# EasyEDA Pro project Schematics with ESP32.eprj

# Schematic ESP-32-rect
Board Name: ESP-32-rect; Create Date: 2026-05-15; Page Name: ESP-32; Project Name: Schematics with ESP32; Schematic Name: ESP-32-rect; Update Date: 2026-05-16; Add into BOM: yes; Company: Your Company; Convert to PCB: yes; Date: 2024-03-01; Draw By: varadshinde60; REV: 1.0; Sheet: 1/1; spicePre: .
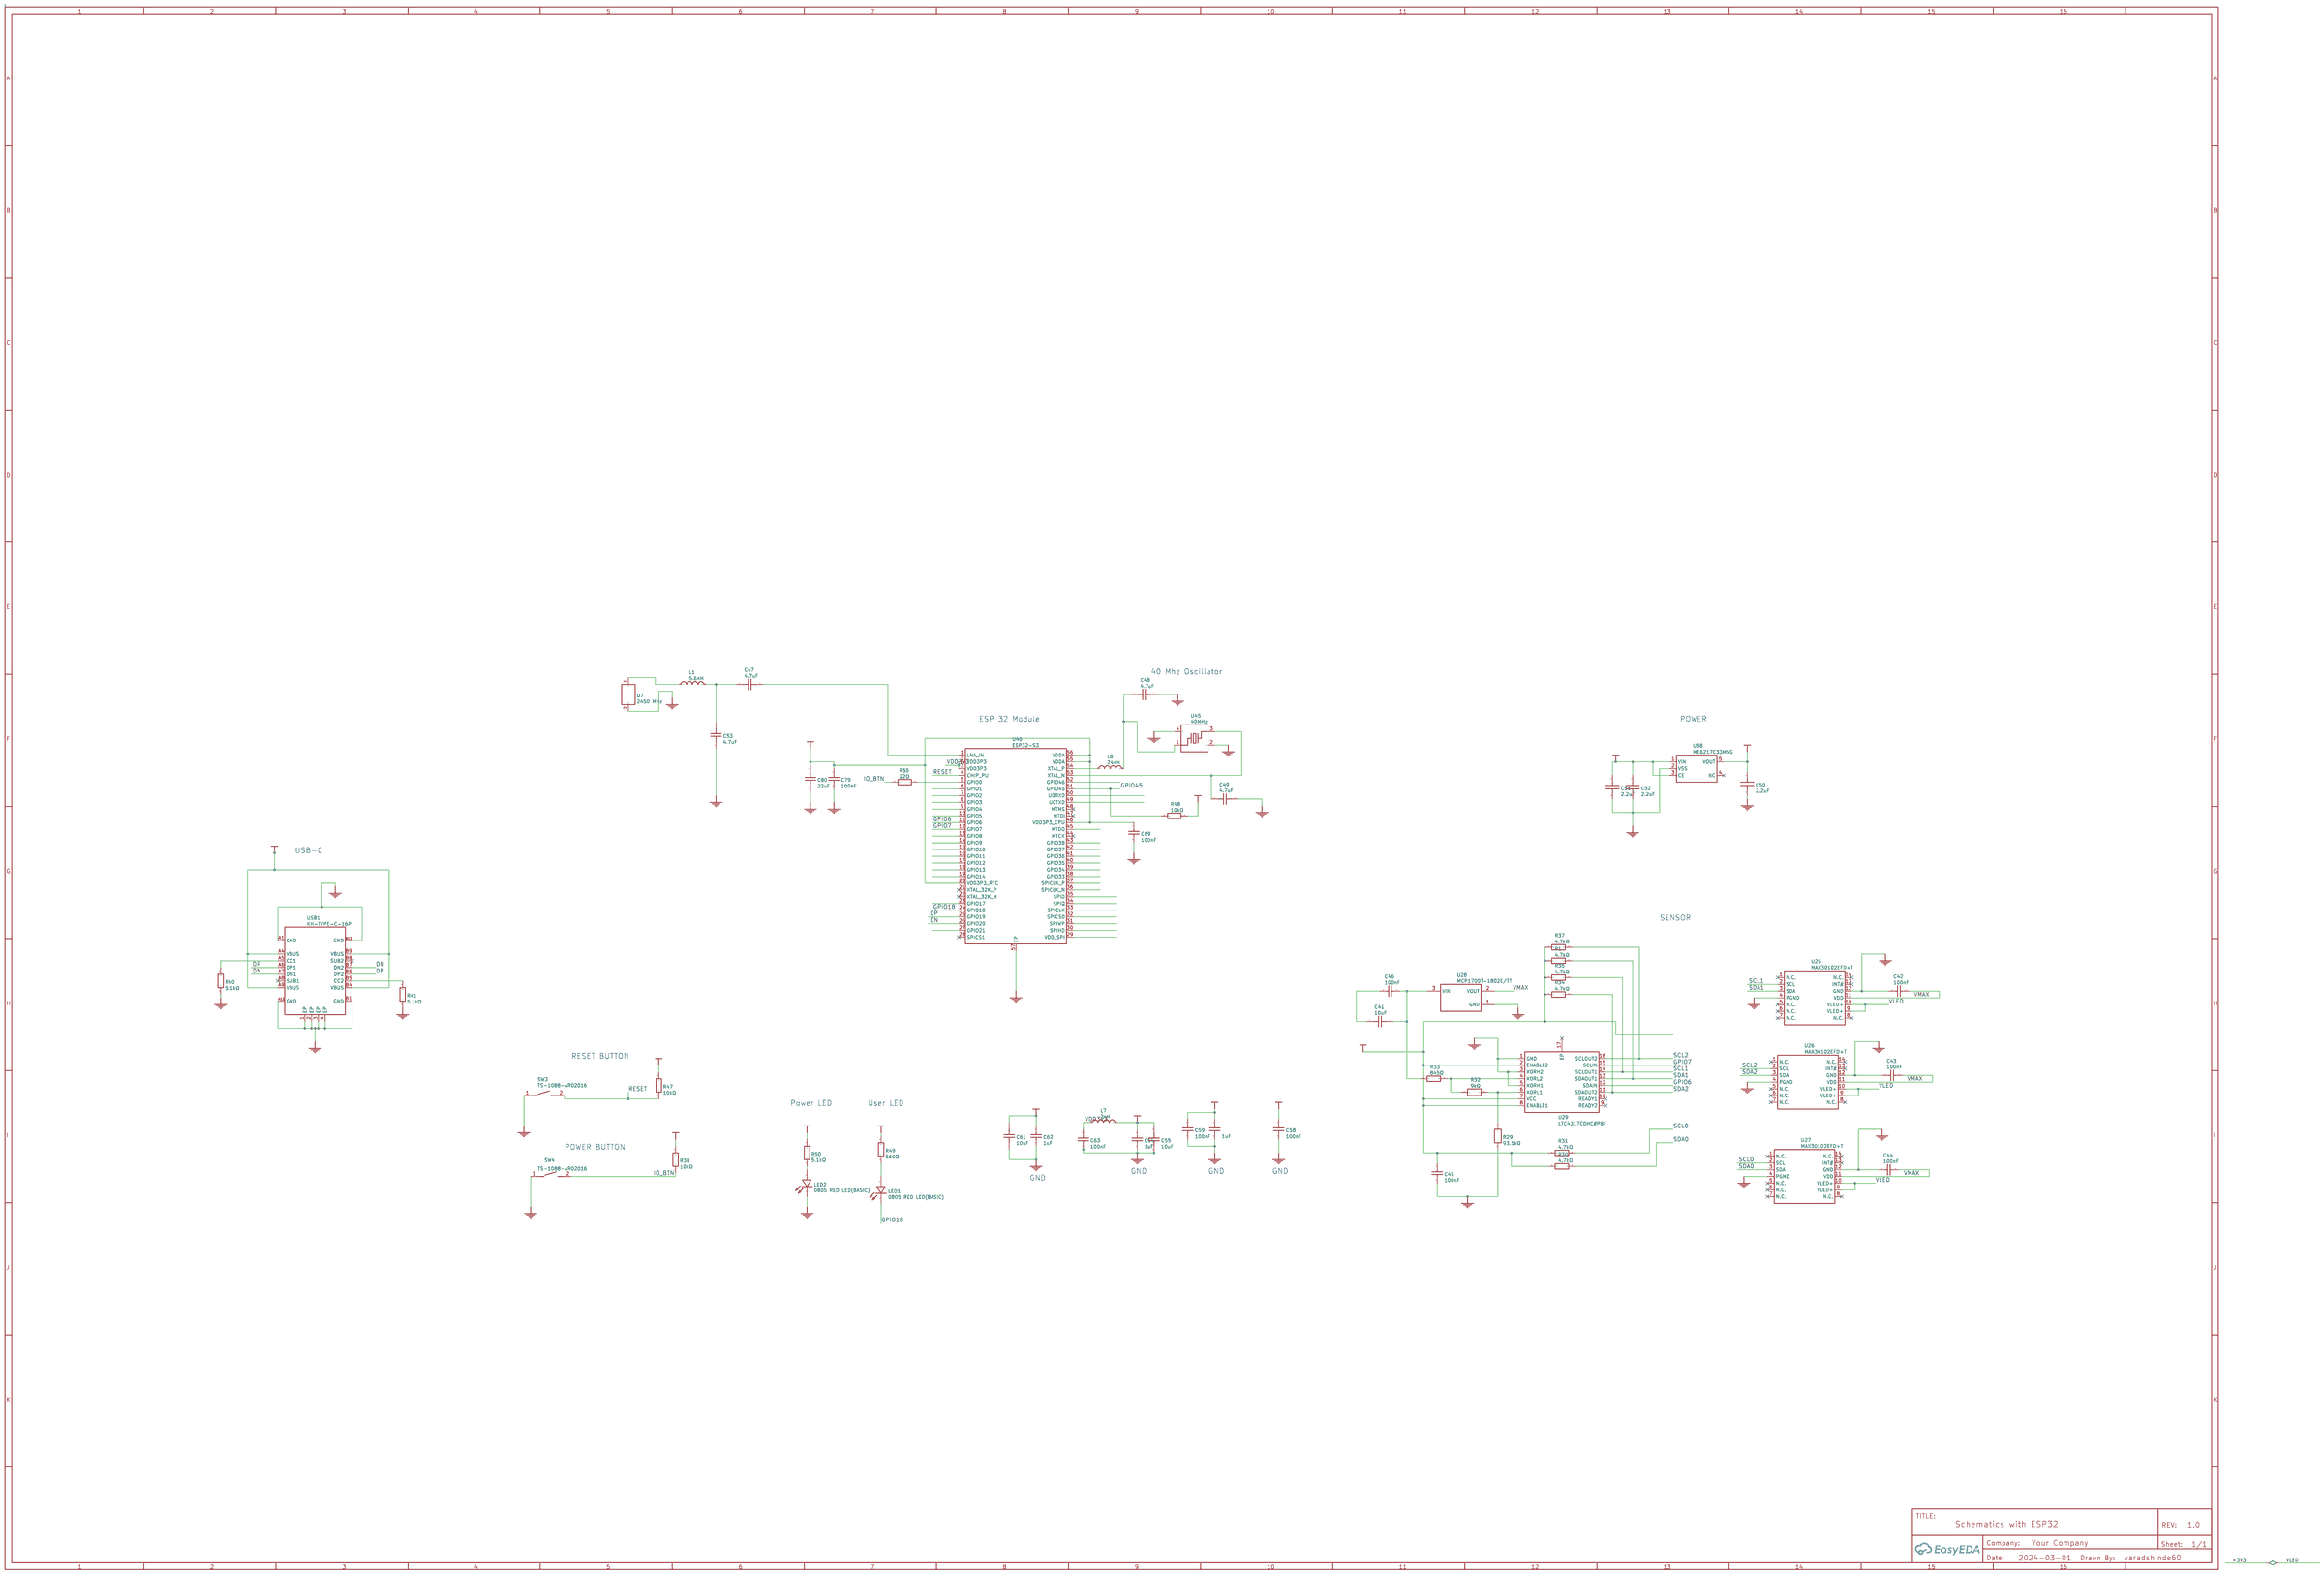
[diagram p0: schematic sheet]

## Parts
C41  10uF  [C0402]
C42  100nF  [C0402]
C43  100nF  [C0402]
C44  100nF  [C0402]
C45  100nF  [C0402]
C46  100nF  [C0402]
C47  4.7uF  [C0402]
C48  4.7uF  [C0402]
C49  4.7uF  [C0402]
C50  2.2uF  [C0402]
C51  2.2uF  [C0402]
C52  2.2uF  [C0402]
C53  4.7uF  [C0402]
C54  1uF  [C0603]
C55  10uF  [C0402]
C58  100nF  [C0402]
C59  100nF  [C0402]
C60  1uF  [C0603]
C61  10uF  [C0402]
C62  1uF  [C0603]
C63  100nF  [C0402]
C69  100nF  [C0402]
C79  100nF  [C0402]
C80  22uF  [C0805]
L1  5.6nH  [L0402]
L7  2nH  [L0201]
L8  24nH  [L0402-RD]
LED1  0805 RED LED(BASIC)  [LED0805-RD_RED]
LED2  0805 RED LED(BASIC)  [LED0805-RD_RED]
R1  4.7kΩ  [R0402]
R29  93.1kΩ  [R0201]
R30  4.7kΩ  [R0402]
R31  4.7kΩ  [R0402]
R32  9kΩ  [R0805]
R33  845Ω  [R0402]
R34  4.7kΩ  [R0402]
R35  4.7kΩ  [R0402]
R37  4.7kΩ  [R0402]
R38  10kΩ  [R0402]
R40  5.1kΩ  [R0402]
R41  5.1kΩ  [R0402]
R47  10kΩ  [R0402]
R48  10kΩ  [R0402]
R49  560Ω  [R0402]
R50  5.1kΩ  [R0402]
R55  22Ω  [R0402]
SW3  TS-1088-AR02016  [SW-SMD_L3.9-W3.0-P4.45]
SW4  TS-1088-AR02016  [SW-SMD_L3.9-W3.0-P4.45]
U7  2450 MHz  [FILTER-SMD_1206-2P-L3.2-W1.6-L]
U25  MAX30102EFD+T
U26  MAX30102EFD+T
U27  MAX30102EFD+T
U28  MCP1700T-1802E/TT  [SOT-23-3_L2.9-W1.3-P1.90-LS2.4-BR]
U29  LTC4317CDHC#PBF
U38  ME6217C33M5G  [SOT-23-5_L3.0-W1.7-P0.95-LS2.8-BR]
U45  40MHz  [CRYSTAL-SMD_4P-L3.2-W2.5-BL]
U46  ESP32-S3
USB1  KH-TYPE-C-16P  [USB-C-SMD_KH-TYPE-C-16P]

## Library data of the parts
C41 C55 C61 = 10uF: Supplier: LCSC; Supplier Part: C315248; Manufacturer: SAMSUNG(三星); Manufacturer Part: CL05A106MP5NUNC; JLCPCB Part Class: Extended Part; link: https://lcsc.com/eda_search?q=C315248&%26type=1&ref=editor; nameAlias: Value; Contributor: LCSC; spicePre: C; spiceSymbolName: CL05A106MP5NUNC_C315248
C42-C46 C58 C59 C63 C69 C79 = 100nF: Supplier: LCSC; Manufacturer Part: CL05B104KO5NNNC; Manufacturer: SAMSUNG(三星); Supplier Part: C1525; JLCPCB Part Class: Basic Part; link: https://lcsc.com/eda_search?q=C1525&%26type=1&ref=editor; nameAlias: Value; spicePre: C; spiceSymbolName: CL05B104KO5NNNC
C47-C49 C53 = 4.7uF: Supplier: LCSC; Supplier Part: C368809; Manufacturer: SAMSUNG(三星); Manufacturer Part: CL05A475KP5NRNC; JLCPCB Part Class: Extended Part; link: https://lcsc.com/eda_search?q=C368809&%26type=1&ref=editor; nameAlias: Value; Contributor: LCSC; spicePre: C; spiceSymbolName: CL05A475KP5NRNC
C50-C52 = 2.2uF: Supplier: LCSC; Manufacturer Part: CL05A225MQ5NSNC; Manufacturer: SAMSUNG(三星); Supplier Part: C12530; JLCPCB Part Class: Basic Part; nameAlias: Value; spicePre: C; spiceSymbolName: CL05A225MQ5NSNC
C54 C60 C62 = 1uF: Supplier: LCSC; Manufacturer Part: CL10A105KA8NNNC; Manufacturer: SAMSUNG(三星); Supplier Part: C5673; JLCPCB Part Class: Extended Part; link: https://lcsc.com/eda_search?q=C5673&%26type=1&ref=editor; nameAlias: Value; spicePre: C; spiceSymbolName: CL10A105KA8NNNC
C80 = 22uF: Supplier: LCSC; Supplier Part: C602037; Manufacturer: SAMSUNG(三星); Manufacturer Part: CL21A226MAYNNNE; JLCPCB Part Class: Extended Part; link: https://lcsc.com/eda_search?q=C602037&%26type=1&ref=editor; nameAlias: Value; Contributor: LCSC; spicePre: C; spiceSymbolName: CL21A226MAYNNNE
L1 = 5.6nH: Supplier: LCSC; Supplier Part: C370228; Manufacturer: Sunlord(顺络); Manufacturer Part: SDCL1005C5N6CTDFM01; JLCPCB Part Class: Extended Part; nameAlias: Value; Contributor: LCSC; spicePre: L; spiceSymbolName: SDCL1005C5N6CTDFM01
L7 = 2nH: Supplier: LCSC; Supplier Part: C307709; Manufacturer: TDK; Manufacturer Part: MLG0603P2N0BT000; JLCPCB Part Class: Extended Part; nameAlias: Value; Contributor: LCSC; spicePre: L; spiceSymbolName: MLG0603P2N0BT000
L8 = 24nH: Supplier: LCSC; Manufacturer Part: SDCL1005C24NJTDF; Manufacturer: Sunlord(顺络); Supplier Part: C74301; JLCPCB Part Class: Extended Part; nameAlias: Value; spicePre: L; spiceSymbolName: SDCL1005C24NJTDF
LED1 LED2 = 0805 RED LED(BASIC): Supplier: LCSC; Manufacturer: 国星光电; Manufacturer Part: NCD0805R1; Supplier Part: C84256; JLCPCB Part Class: Basic Part; spicePre: L
R1 R30 R31 R34 R35 R37 = 4.7kΩ: Supplier: LCSC; Manufacturer: UNI-ROYAL(厚声); Manufacturer Part: 0402WGF4701TCE; Supplier Part: C25900; JLCPCB Part Class: Basic Part; nameAlias: Value; spicePre: R; spiceSymbolName: 0402WGF4701TCE
R29 = 93.1kΩ: Supplier: LCSC; Supplier Part: C367713; Manufacturer: Walsin(华新科); Manufacturer Part: WR02X9312FTL; nameAlias: Value; Contributor: LCSC; spicePre: R; spiceSymbolName: WR02X9312FTL
R32 = 9kΩ: Supplier: LCSC; Supplier Part: C2930212; Manufacturer: FOJAN(富捷); Manufacturer Part: FRC0805F9001TS; JLCPCB Part Class: Extended Part; nameAlias: Value; Contributor: lcsc; spicePre: R; spiceSymbolName: FRC0805F9001TS
R33 = 845Ω: Supplier: LCSC; Supplier Part: C334737; Manufacturer: Walsin(华新科); Manufacturer Part: WR04X8450FTL; JLCPCB Part Class: Extended Part; nameAlias: Value; Contributor: LCSC; spicePre: R; spiceSymbolName: WR04X8450FTL
R38 R47 R48 = 10kΩ: Supplier: LCSC; Manufacturer: UNI-ROYAL(厚声); Manufacturer Part: 0402WGF1002TCE; Supplier Part: C25744; JLCPCB Part Class: Basic Part; link: https://lcsc.com/eda_search?q=C25744&%26type=1&ref=editor; nameAlias: Value; spicePre: R; spiceSymbolName: 0402WGF1002TCE
R40 R41 R50 = 5.1kΩ: Supplier: LCSC; Manufacturer: UNI-ROYAL(厚声); Manufacturer Part: 0402WGF5101TCE; Supplier Part: C25905; JLCPCB Part Class: Basic Part; link: https://lcsc.com/eda_search?q=C25905&%26type=1&ref=editor; nameAlias: Value; spicePre: R; spiceSymbolName: 0402WGF5101TCE
R49 = 560Ω: Supplier: LCSC; Manufacturer: UNI-ROYAL(厚声); Manufacturer Part: 0402WGF5600TCE; Supplier Part: C25126; JLCPCB Part Class: Extended Part; link: https://lcsc.com/eda_search?q=C25126&%26type=1&ref=editor; nameAlias: Value; spicePre: R; spiceSymbolName: 0402WGF5600TCE
R55 = 22Ω: Supplier: LCSC; Manufacturer: UNI-ROYAL(厚声); Manufacturer Part: 0402WGF220JTCE; Supplier Part: C25092; JLCPCB Part Class: Basic Part; link: https://lcsc.com/eda_search?q=C25092&%26type=1&ref=editor; nameAlias: Value; spicePre: R; spiceSymbolName: 0402WGF220JTCE
SW3 SW4 = TS-1088-AR02016: Supplier: LCSC; Supplier Part: C720477; Manufacturer: XUNPU(讯普); JLCPCB Part Class: Extended Part; Contributor: LCSC; spicePre: S
U7 = 2450 MHz: Supplier: LCSC; Supplier Part: C127629; Manufacturer: Walsin(华新科); Manufacturer Part: RFANT3216120A5T; JLCPCB Part Class: Extended Part; Contributor: LCSC; nameAlias: Value; spicePre: U; spiceSymbolName: RFANT3216120A5T
U25-U27 = MAX30102EFD+T: Supplier: LCSC; Supplier Part: C9900007468; Manufacturer: null; JLCPCB Part Class: Extended Part; Contributor: LCSC; spicePre: U
U28 = MCP1700T-1802E/TT: Supplier: LCSC; Manufacturer: MICROCHIP(美国微芯); Supplier Part: C150796; JLCPCB Part Class: Extended Part; Contributor: LCSC; spicePre: U
U29 = LTC4317CDHC#PBF: Supplier: LCSC; Supplier Part: C688151; Manufacturer: ADI(亚德诺)/LINEAR(凌特); JLCPCB Part Class: Extended Part; Contributor: LCSC; spicePre: U
U38 = ME6217C33M5G: Supplier: LCSC; Supplier Part: C427602; Manufacturer: MICRONE(南京微盟); JLCPCB Part Class: Extended Part; Contributor: LCSC; spicePre: U
U45 = 40MHz: Supplier: LCSC; Supplier Part: C1986546; Manufacturer: Kyocera AVX; Manufacturer Part: CX3225SB40000D0FFFCC; JLCPCB Part Class: Extended Part; Contributor: lcsc; nameAlias: Value; spicePre: U; spiceSymbolName: CX3225SB40000D0FFFCC
U46 = ESP32-S3: Supplier: LCSC; Supplier Part: C2913192; Manufacturer: ESPRESSIF(乐鑫); JLCPCB Part Class: Extended Part; Contributor: LCSC; spicePre: U
USB1 = KH-TYPE-C-16P: Supplier: LCSC; Supplier Part: C709357; Manufacturer: kinghelm(金航标); JLCPCB Part Class: Extended Part; Contributor: LCSC; spicePre: U

## Nets
+3V3: C45.2 C50.1 C54.2 C55.2 C58.2 C59.2 C60.2 C61.2 C62.2 C69.1 C79.1 C80.2 L7.2 R1.1 R30.1 R31.1 R34.1 R35.1 R37.1 R38.2 R47.2 R48.1 R49.2 R50.2 U25.9(VLED+) U25.10(VLED+) U26.9(VLED+) U26.10(VLED+) U27.9(VLED+) U27.10(VLED+) U29.2(ENABLE2) U29.7(VCC) U29.8(ENABLE1) U38.5(VOUT) U46.20(VDD3P3_RTC) U46.46(VDD3P3_CPU) U46.55(VDDA) U46.56(VDDA)
+5V_BUS: C51.2 C52.1 U38.1(VIN) U38.3(CE) USB1.A4(VBUS) USB1.A9(VBUS) USB1.B4(VBUS) USB1.B9(VBUS)
GND: C42.1 C43.1 C44.1 C45.1 C48.1 C49.1 C50.2 C51.1 C52.2 C53.2 C54.1 C55.1 C58.1 C59.1 C60.1 C61.1 C62.1 C63.1 C69.2 C79.2 C80.1 LED2.1(-) R29.1 R40.1 R41.1 SW3.1 SW4.1 U7.2 U25.4(PGND) U25.12(GND) U26.4(PGND) U26.12(GND) U27.4(PGND) U27.12(GND) U28.1(GND) U29.1(GND) U29.3(XORH2) U29.5(XORH1) U38.2(VSS) U45.2(GND) U45.4(GND) U46.57(EP) USB1.1(EP) USB1.2(EP) USB1.3(EP) USB1.4(EP) USB1.A1(GND) USB1.A12(GND) USB1.B1(GND) USB1.B12(GND)
VDD3V3: C63.2 L7.1 U46.2(VDD3P3) U46.3(VDD3P3)
DN: U46.26(GPIO20) USB1.A7(DN1) USB1.B7(DN2)
DP: U46.25(GPIO19) USB1.A6(DP1) USB1.B6(DP2)
GPIO6: U29.12(SDAIN) U46.11(GPIO6)
GPIO7: U29.15(SCLIN) U46.12(GPIO7)
GPIO18: LED1.1(-) U46.24(GPIO18)
GPIO45: R48.2 U46.51(GPIO45)
IO_BTN: R38.1 R55.2 SW4.2
RESET: R47.1 SW3.2 U46.4(CHIP_PU)
SCL0: R31.2 U27.2(SCL)
SCL1: R35.2 U25.2(SCL) U29.14(SCLOUT1)
SCL2: R37.2 U26.2(SCL) U29.16(SCLOUT2)
SDA0: R30.2 U27.3(SDA)
SDA1: R1.2 U25.3(SDA) U29.13(SDAOUT1)
SDA2: R34.2 U26.3(SDA) U29.11(SDAOUT2)
VMAX: C42.2 C43.2 C44.2 U25.11(VDD) U26.11(VDD) U27.11(VDD) U28.2(VOUT)
Net-(C41-1): C41.1 C46.2 R33.1 U28.3(VIN)
Net-(C41-2): C41.2 C46.1
Net-(C47-1): C47.1 U46.1(LNA_IN)
Net-(C47-2): C47.2 C53.1 L1.2
Net-(C48-2): C48.2 L8.2 U45.1
Net-(C49-2): C49.2 U45.3 U46.53(XTAL_N)
Net-(L1-1): L1.1 U7.1
Net-(L8-1): L8.1 U46.54(XTAL_P)
Net-(LED1-2): LED1.2(+) R49.1
Net-(LED2-2): LED2.2(+) R50.1
Net-(R29-2): R29.2 R32.2 U29.6(XORL1)
Net-(R32-1): R32.1 R33.2 U29.4(XORL2)
Net-(R40-2): R40.2 USB1.A5(CC1)
Net-(R41-2): R41.2 USB1.B5(CC2)
Net-(R55-1): R55.1 U46.5(GPIO0)

Not connected (* = marked no-connect by the designer): U25 1(N.C.)* 5(N.C.)* 6(N.C.)* 7(N.C.)* 8(N.C.)* 13(INT#)* 14(N.C.)*; U26 1(N.C.)* 5(N.C.)* 6(N.C.)* 7(N.C.)* 8(N.C.)* 13(INT#)* 14(N.C.)*; U27 1(N.C.)* 5(N.C.)* 6(N.C.)* 7(N.C.)* 8(N.C.)* 13(INT#)* 14(N.C.)*; U29 9(READY2)* 10(READY1)* 17(EP)*; U38 4(NC)*; U46 6(GPIO1) 7(GPIO2) 8(GPIO3) 9(GPIO4) 10(GPIO5) 13(GPIO8) 14(GPIO9) 15(GPIO10) 16(GPIO11) 17(GPIO12) 18(GPIO13) 19(GPIO14) 21(XTAL_32K_P)* 22(XTAL_32K_N)* 23(GPIO17) 27(GPIO21) 28(SPICS1)* 29(VDD_SPI) 30(SPIHD) 31(SPIWP) 32(SPICS0) 33(SPICLK) 34(SPIQ) 35(SPID) 36(SPICLK_N) 37(SPICLK_P) 38(GPIO33) 39(GPIO34) 40(GPIO35) 41(GPIO36) 42(GPIO37) 43(GPIO38) 44(MTCK)* 45(MTDO) 47(MTDI)* 48(MTMS)* 49(U0TXD) 50(U0RXD) 52(GPIO46); USB1 A8(SUB1)* B8(SUB2)*

## Notes on the sheet
- 40 Mhz Oscillator
- ESP 32 Module
- POWER
- USB-C
- SENSOR
- RESET BUTTON
- Power LED
- User LED
- POWER BUTTON
- GND
- GND
- GND
- GND

# Schematic ESP8266 - DHT22
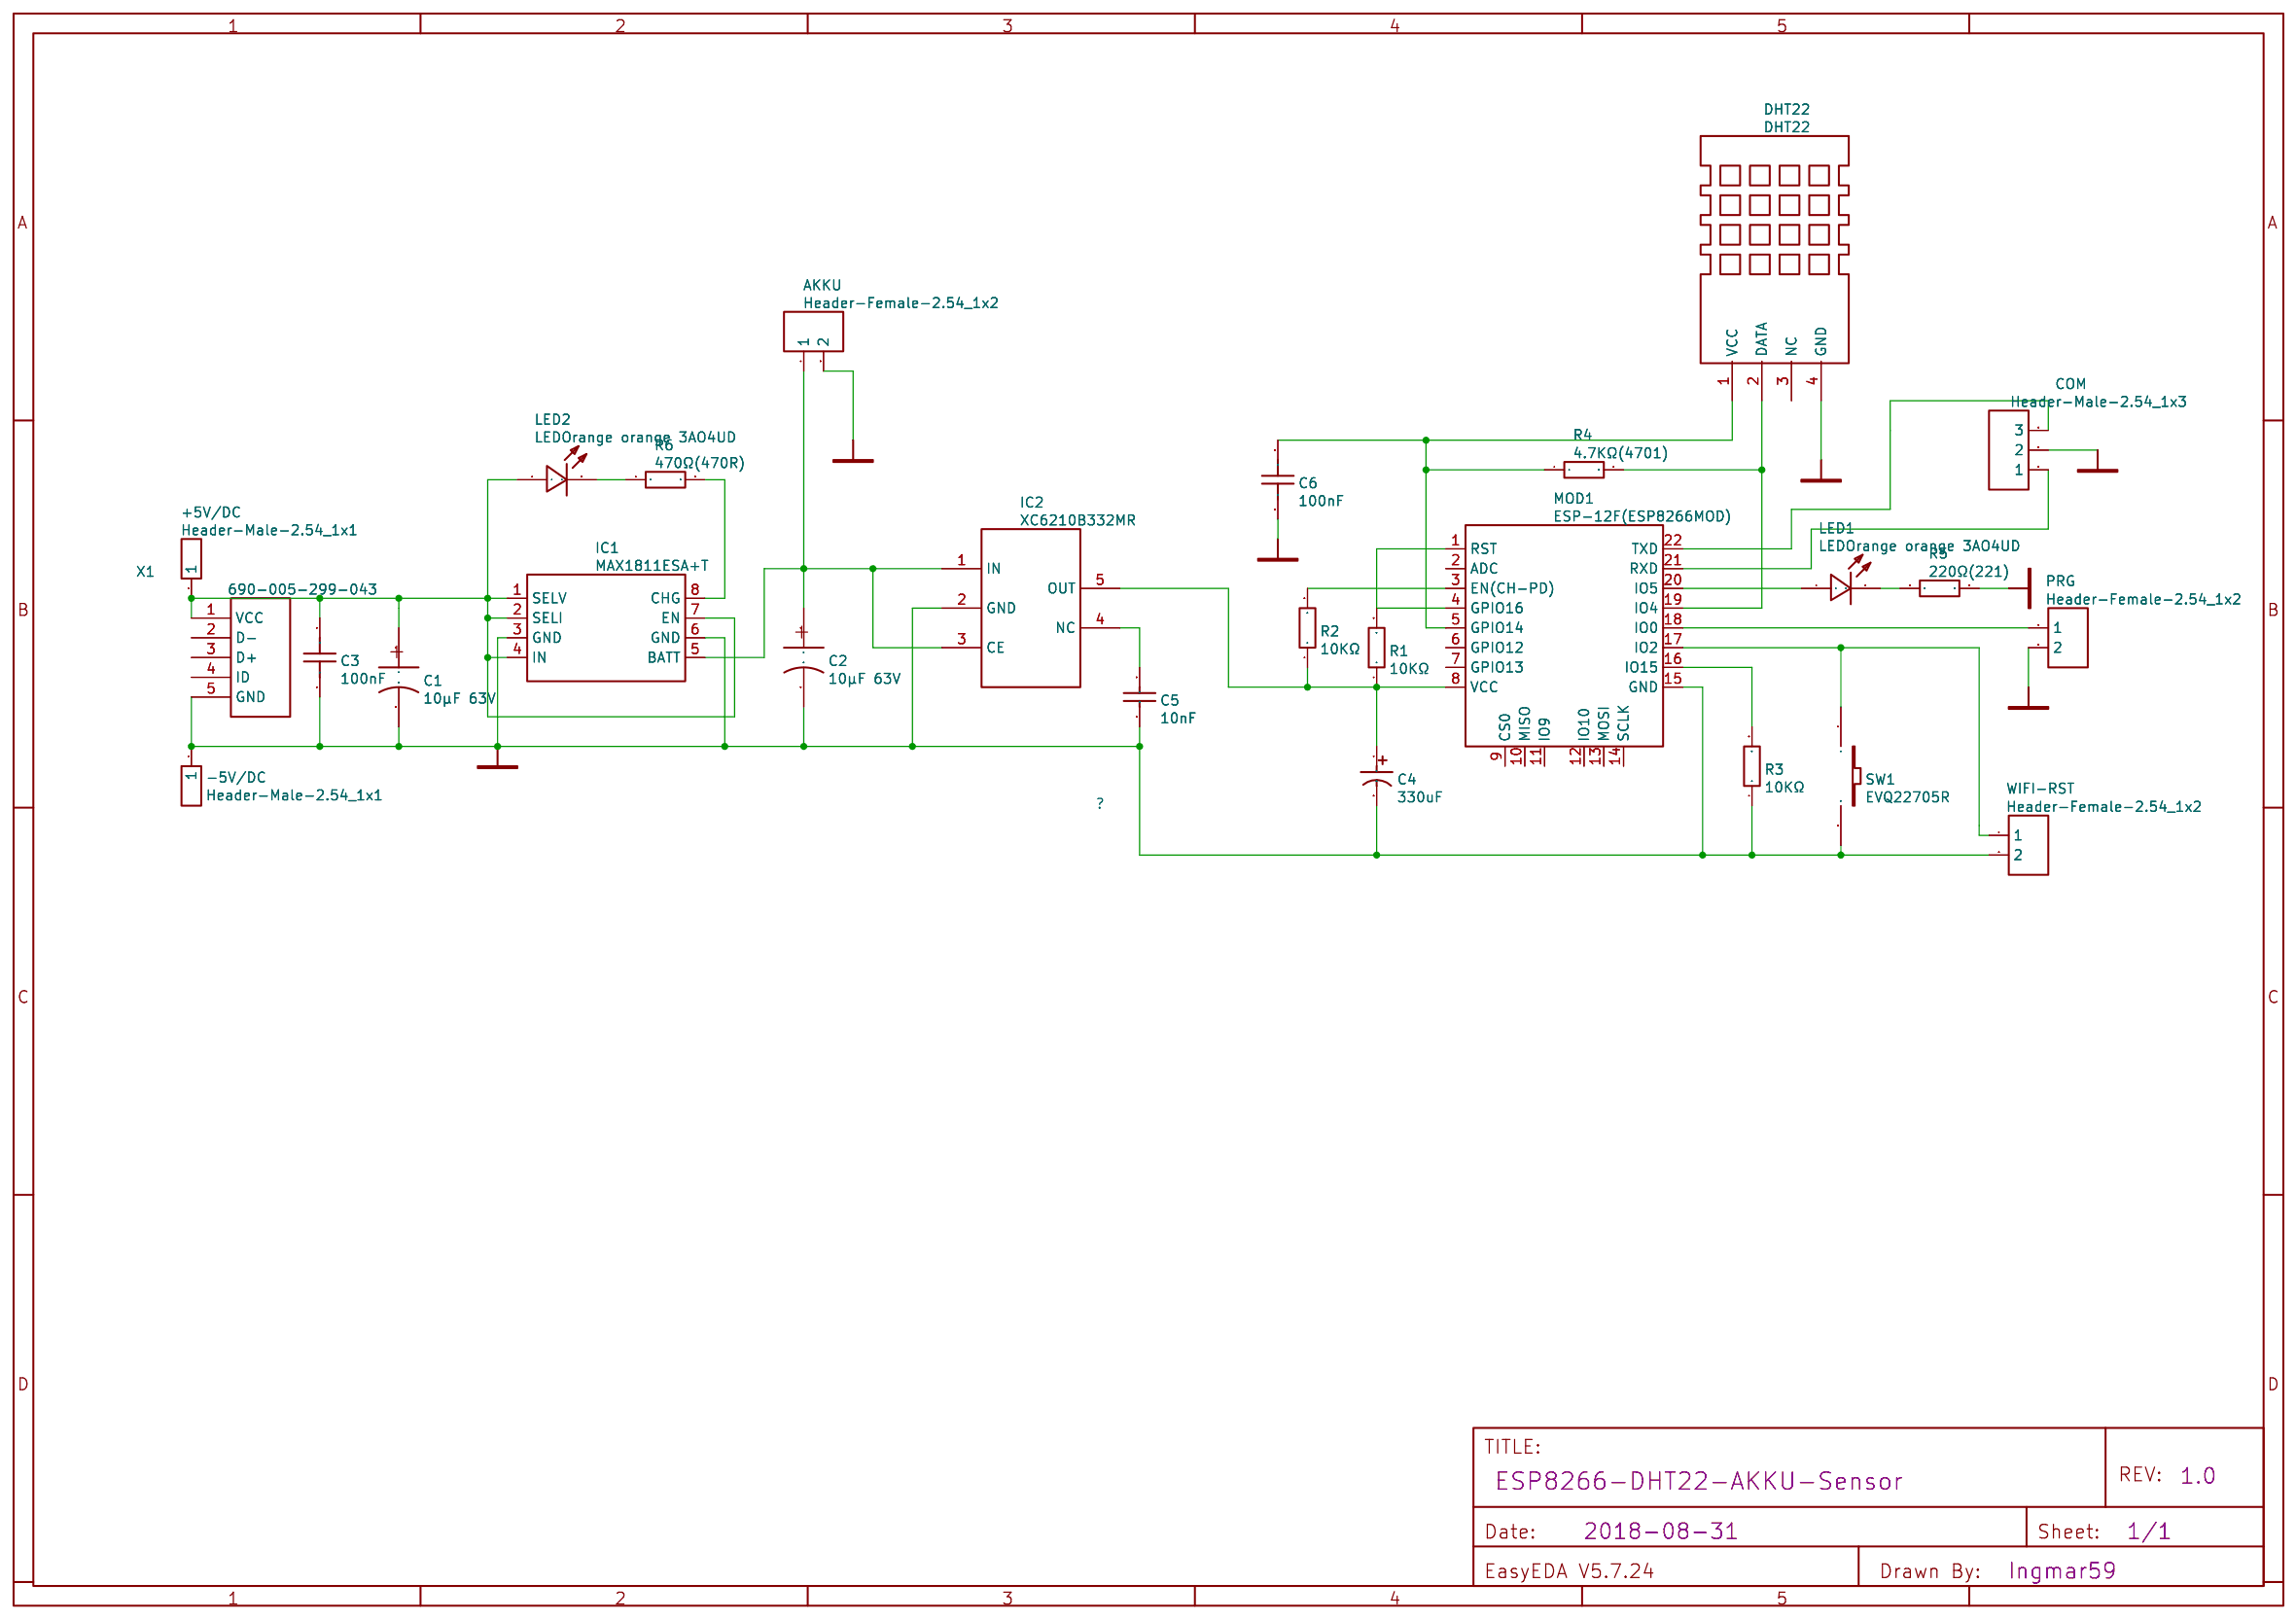
[diagram p1: schematic sheet]

## Parts
+5V/DC  Header-Male-2.54_1x1
-5V/DC  Header-Male-2.54_1x1
AKKU  Header-Female-2.54_1x2
C1  10µF 63V
C2  10µF 63V
C3  100nF
C4  330uF
C5  10nF
C6  100nF
COM  Header-Male-2.54_1x3
DHT22  DHT22
IC1  MAX1811ESA+T
IC2  XC6210B332MR
LED1  LEDOrange orange 3AO4UD
LED2  LEDOrange orange 3AO4UD
MOD1  ESP-12F(ESP8266MOD)
PRG  Header-Female-2.54_1x2
R1  10KΩ
R2  10KΩ
R3  10KΩ
R4  4.7KΩ(4701)
R5  220Ω(221)
R6  470Ω(470R)
SW1  EVQ22705R
WIFI-RST  Header-Female-2.54_1x2
X1  690-005-299-043

## Library data of the parts
+5V/DC -5V/DC = Header-Male-2.54_1x1: Supplier: LCSC; Manufacturer: ReliaPro; Supplier Part: C81276; Contributor: LCSC; spicePre: P
AKKU PRG WIFI-RST = Header-Female-2.54_1x2: Supplier: LCSC; Manufacturer: BOOMELE; Manufacturer Part: 2.54-1*2PFemale; image: //image.lceda.cn/szlcsc/C49661.jpg; Supplier Part: C49661; Contributor: LCSC; spicePre: P
C1 C2 = 10µF 63V: Manufacturer Part: UPW1J100MDD1TD; Supplier Part: 2841920; Supplier: Element14; Capacitance: 10µf; Tolerance: ±20%; Manufacturer: Nichicon; Voltage: 63V; Contributor: xdc_2017; spicePre: C
C3 C6 = 100nF: Supplier: LCSC; Manufacturer: WTC; Manufacturer Part: 1206F104Z500; Supplier Part: C152824; nameAlias: Capacitance; Contributor: LCSC; spicePre: C; spiceSymbolName: 1206F104Z500
C4 = 330uF: Supplier: LCSC; Manufacturer: Nichicon; Manufacturer Part: UHE1V331MPD; Supplier Part: C116236; nameAlias: Capacitance; Contributor: LCSC; spicePre: C; spiceSymbolName: UHE1V331MPD
C5 = 10nF: Supplier: LCSC; Manufacturer: SAMSUNG; Manufacturer Part: CL31B103KBCNNNC; Supplier Part: C153292; nameAlias: Capacitance; Contributor: LCSC; spicePre: C; spiceSymbolName: CL31B103KBCNNNC
COM = Header-Male-2.54_1x3: Supplier: LCSC; Manufacturer: BOOMELE; Manufacturer Part: Header2.54mm 1*3P; image: //image.lceda.cn/szlcsc/C49257.jpg; Supplier Part: C49257; Contributor: LCSC; spicePre: P
DHT22 = DHT22: Digital-output relative humidity & temperature sensor/module; Supplier Part: PRODUCT ID: 385; Supplier: AdaFruit; Voltage: 3.3V - 5.5V; Mounted: Yes; Manufacturer: Aosong (Guangzhou) Electronics Co., Ltd.; Manufacturer Part: ?; timeStamp: 1469804316; sourceId: GkiDrp9vf; spicePre: U
IC1 = MAX1811ESA+T: Supplier: LCSC; Manufacturer: MAXIM; Supplier Part: C49303; Contributor: LCSC; spicePre: U
IC2 = XC6210B332MR: Supplier: LCSC; Manufacturer: TOREX; image: //image.lceda.cn/szlcsc/C47719.jpg; Supplier Part: C47719; Contributor: LCSC; spicePre: U
LED1 LED2 = LEDOrange orange 3AO4UD: Supplier: LCSC; Manufacturer: KENTO; image: //image.lceda.cn/szlcsc/C62095.jpg; Supplier Part: C62095; Contributor: LCSC; spicePre: L
MOD1 = ESP-12F(ESP8266MOD): Supplier: LCSC; Manufacturer: Ai-Thinker; Supplier Part: C82891; Contributor: LCSC; spicePre: U
R1-R3 = 10KΩ: Supplier: LCSC; Manufacturer: UniOhm; Manufacturer Part: 1210W3J0103T5E; Supplier Part: C25672; nameAlias: Value; Contributor: LCSC; spicePre: R; spiceSymbolName: 1210W3J0103T5E
R4 = 4.7KΩ(4701): Supplier: LCSC; Manufacturer: YAGEO; Manufacturer Part: RC1206FR-074K7L; Supplier Part: C137262; nameAlias: Value; Contributor: LCSC; spicePre: R; spiceSymbolName: RC1206FR-074K7L
R5 = 220Ω(221): Supplier: LCSC; Manufacturer: LIZ; Manufacturer Part: CR1206J40221G; Supplier Part: C102308; nameAlias: Value; Contributor: LCSC; spicePre: R; spiceSymbolName: CR1206J40221G
R6 = 470Ω(470R): Supplier: LCSC; Manufacturer: YAGEO; Manufacturer Part: RC1206FR-07470RL; Supplier Part: C114945; nameAlias: Value; Contributor: LCSC; spicePre: R; spiceSymbolName: RC1206FR-07470RL
SW1 = EVQ22705R: Supplier: LCSC; Manufacturer: PANASONIC; Supplier Part: C79156; Contributor: LCSC; spicePre: S
X1 = 690-005-299-043: Supplier Part: 151-1206-1-ND; Supplier: Digi-Key; Contributor: patlunb; spicePre: U

## Nets
GND: -5V/DC.1 AKKU.2 C1.2 C2.2 C3.2 C4.2 C5.1 C6.2 COM.2 DHT22.4(GND) IC1.3(GND) IC1.6(GND) IC2.2(GND) MOD1.15(GND) PRG.2 R3.1 R5.2 SW1.2 WIFI-RST.2 X1.5(GND)
Net-(+5V/DC-1): +5V/DC.1 C1.1 C3.1 IC1.1(SELV) IC1.2(SELI) IC1.4(IN) IC1.7(EN) LED2.1(A) X1.1(VCC)
Net-(AKKU-1): AKKU.1 C2.1 IC1.5(BATT) IC2.1(IN) IC2.3(CE)
Net-(C4-1): C4.1 IC2.5(OUT) MOD1.8(VCC) R1.1 R2.1
Net-(C5-2): C5.2 IC2.4(NC)
Net-(C6-1): C6.1 DHT22.1(VCC) MOD1.5(GPIO14) R4.1
Net-(COM-1): COM.1 MOD1.21(RXD)
Net-(COM-3): COM.3 MOD1.22(TXD)
Net-(DHT22-2): DHT22.2(DATA) MOD1.19(IO4) R4.2
Net-(IC1-8): IC1.8(CHG) R6.2
Net-(LED1-1): LED1.1(A) MOD1.20(IO5)
Net-(LED1-2): LED1.2(K) R5.1
Net-(LED2-2): LED2.2(K) R6.1
Net-(MOD1-1): MOD1.1(RST) MOD1.4(GPIO16) R1.2
Net-(MOD1-3): MOD1.3(EN(CH-PD)) R2.2
Net-(MOD1-16): MOD1.16(IO15) R3.2
Net-(MOD1-17): MOD1.17(IO2) SW1.1 WIFI-RST.1
Net-(MOD1-18): MOD1.18(IO0) PRG.1

Not connected (* = marked no-connect by the designer): DHT22 3(NC); MOD1 2(ADC) 6(GPIO12) 7(GPIO13) 9(CS0) 10(MISO) 11(IO9) 12(IO10) 13(MOSI) 14(SCLK); X1 2(D-) 3(D+) 4(ID)

# Schematic DHT22-AM2302-Sensor
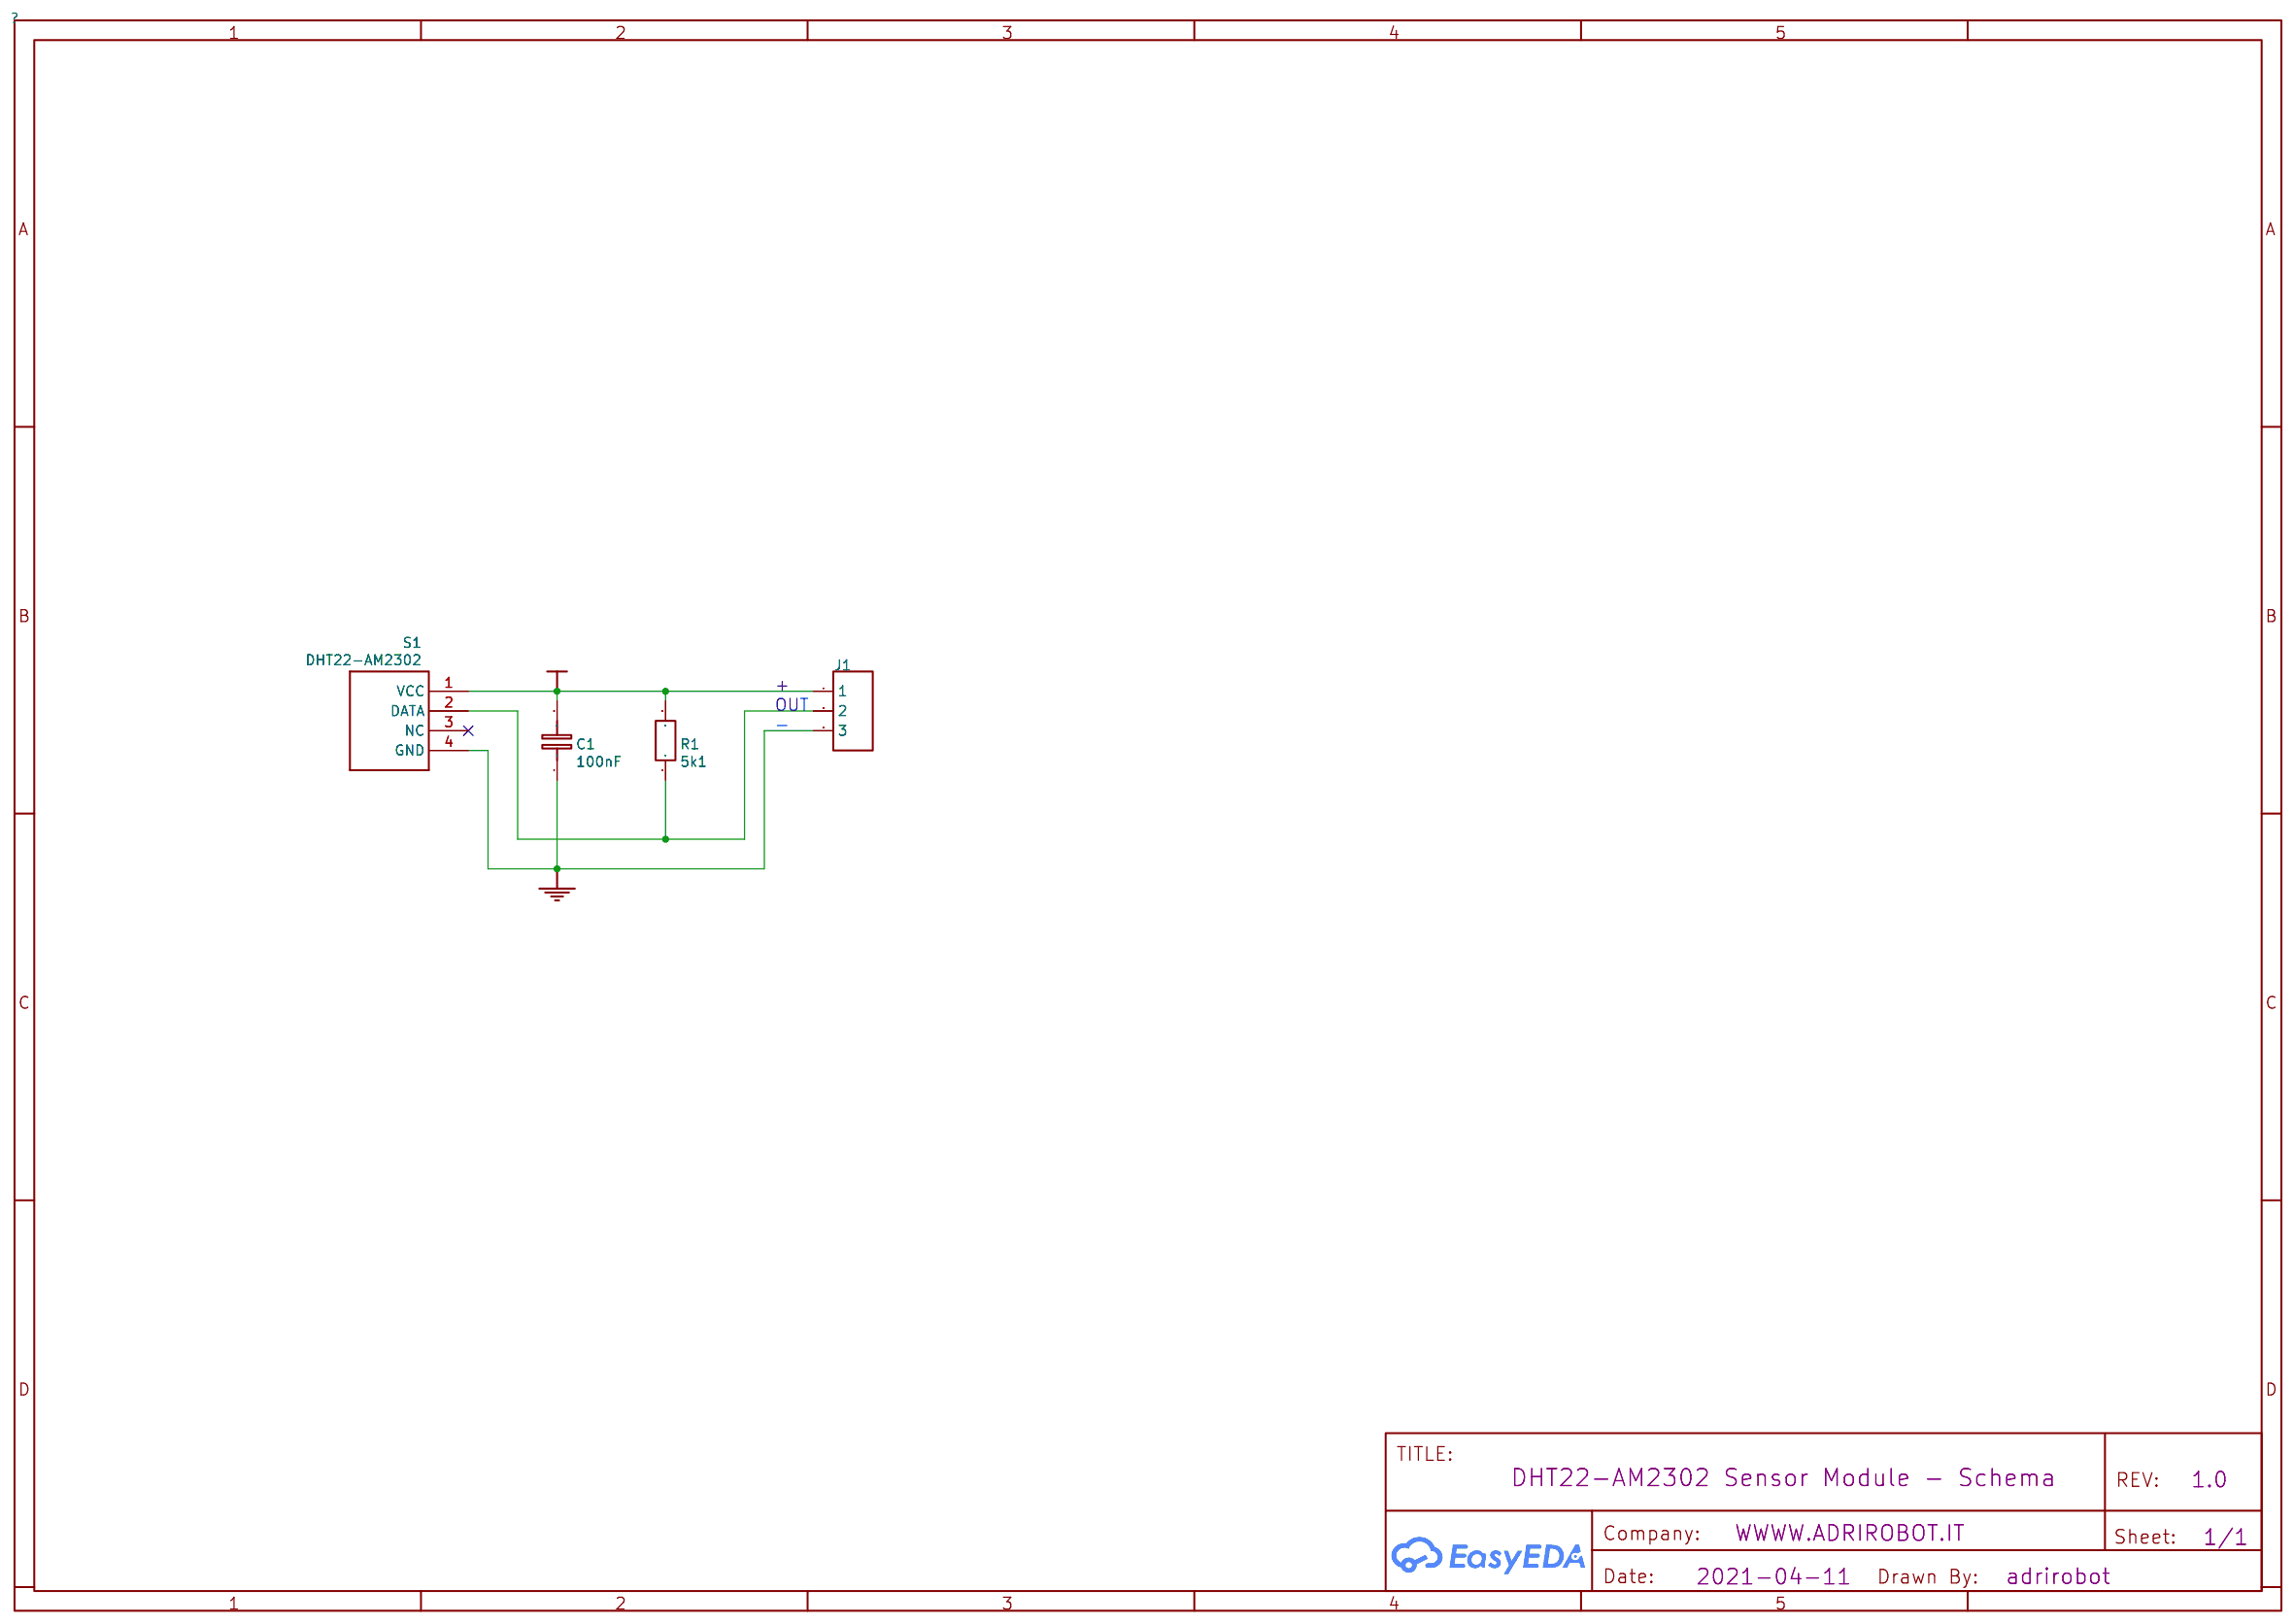
[diagram p2: schematic sheet]

## Parts
C1  100nF  [C0603]
J1  HDR-M-2.54_1x3
R1  5k1  [R0603]
S1  DHT22-AM2302

## Library data of the parts
C1 = 100nF: nameAlias: Value(F); Contributor: LCEDA_Lib; spicePre: C; spiceSymbolName: C_0603_EU
J1 = HDR-M-2.54_1x3: Supplier Part: C180248; Supplier: LCSC; Contributor: LCEDA_Lib; spicePre: J
R1 = 5k1: nameAlias: Value(Ω); Contributor: LCEDA_Lib; spicePre: R; spiceSymbolName: R_0603_EU
S1 = DHT22-AM2302: Manufacturer Part: www.; Contributor: adrirobot; spicePre: S

## Nets
+5V: C1.2 J1.1 R1.2 S1.1(VCC)
GND: C1.1 J1.3 S1.4(GND)
Net-(J1-2): J1.2 R1.1 S1.2(DATA)

Not connected (* = marked no-connect by the designer): S1 3(NC)*

## Notes on the sheet
- +
- OUT
- -
